# EasyEDA Pro project ProPrj_降压模块_2024-09-24.epro

# Schematic Schematic1
Board Name: Board1; Create Date: 2024-09-06
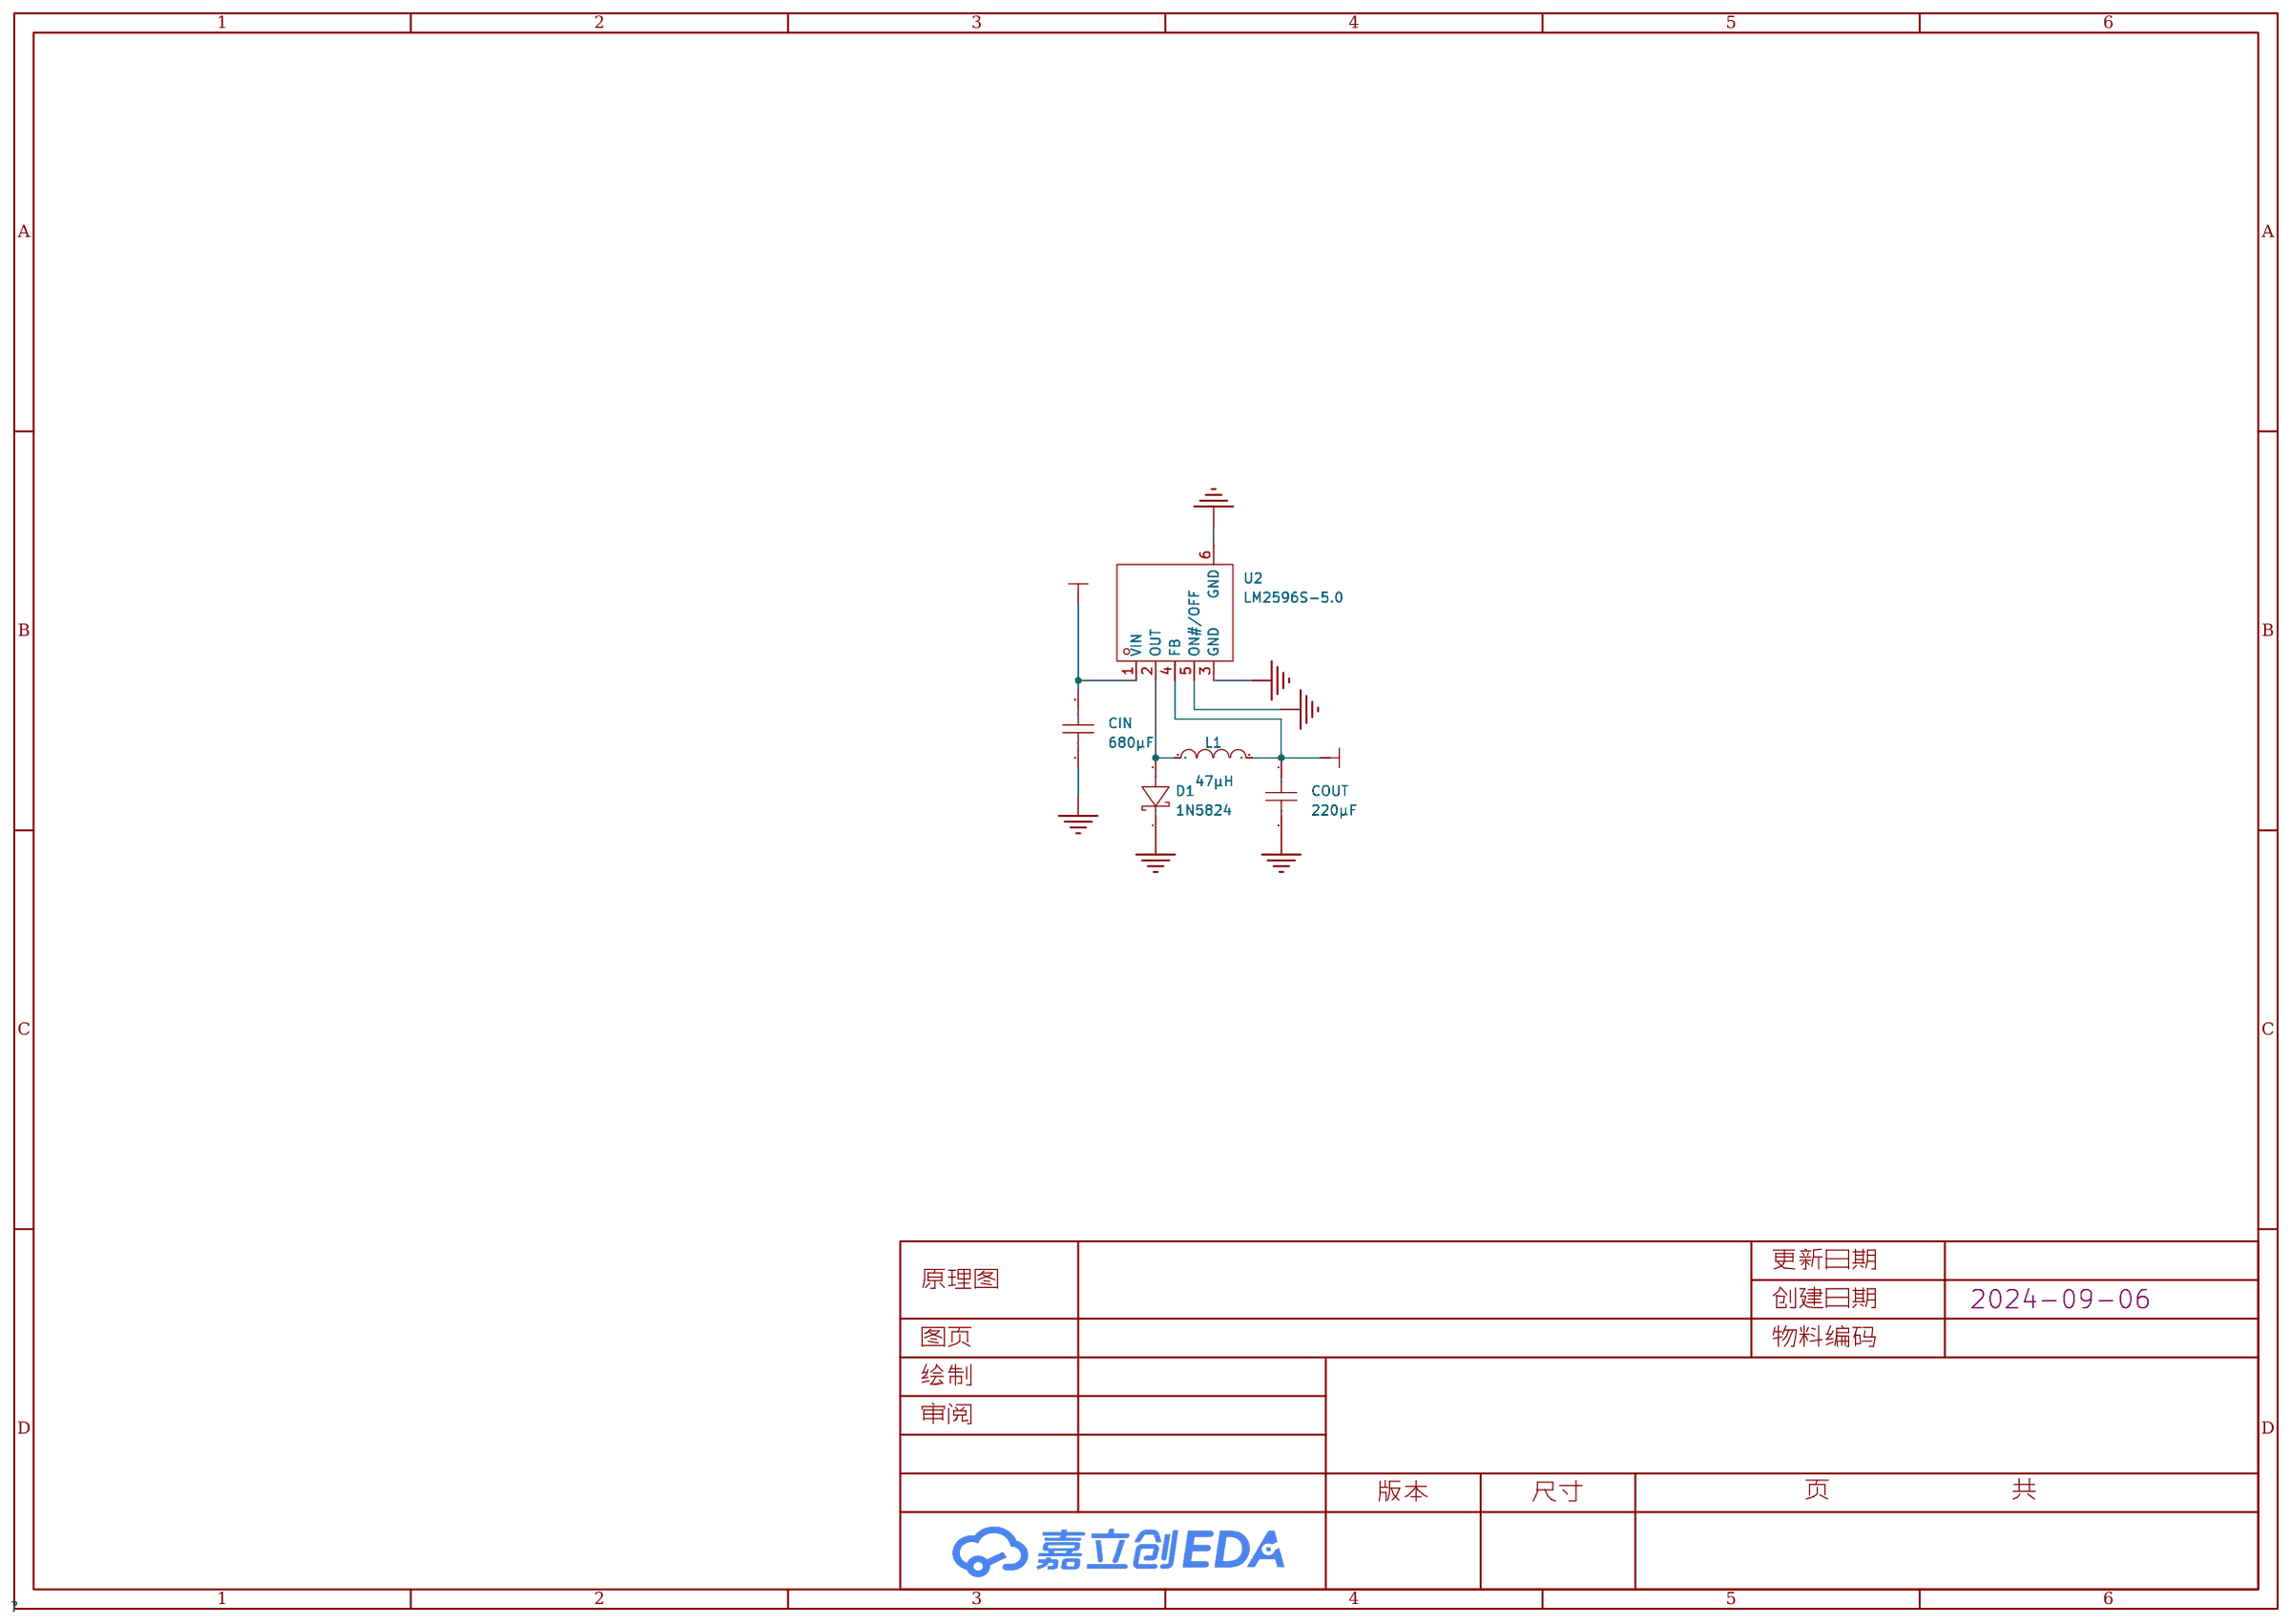
[diagram p0: schematic sheet]

## Parts
CIN  680μF  [C0603]
COUT  220μF  [C0603]
D1  1N5824  [DO-27_BD5.3-L8.4-P12.40-D1.3-RD]
L1  47μH  [L0603]
U2  LM2596S-5.0  [TO-263-5_L10.1-W8.7-P1.70-LS15.2-BR]

## Library data of the parts
CIN COUT = CAP_0603: Supplier Footprint: 0603
D1 = 1N5824_C7503125: 二极管配置:独立式;正向压降(Vf):550mV@5A;直流反向耐压(Vr):30V;平均整流电流(Io):5A;; LCSC Part Name: 电压:30V 电流:5A; Supplier Part: C7503125; Manufacturer: FUXINSEMI(富芯森美); Supplier Footprint: DO-201AD; JLCPCB Part Class: 扩展库; Datasheet: https://atta.szlcsc.com/upload/public/pdf/source/20230904/20F3394C6D1B7A17743713246CA97DB3.pdf; Supplier: LCSC; Diode Configuration: 独立式; Forward Voltage (Vf@If): 550mV@5A; Reverse Voltage (Vr): 30V; Average Rectified Current (Io): 5A; Reverse Leakage Current (Ir): 500uA@30V; Peak forward surge current: 150A
L1 = L_0603
U2 = LM2596S-5.0_C5276750: 功能类型：降压型 输出类型：固定 输入电压：40V 输出电压：5V 输出电流(最大值)：3A; Supplier Part: C5276750; Manufacturer: TWGMC(台湾迪嘉); Supplier Footprint: TO-263-5; JLCPCB Part Class: 扩展库; Datasheet: https://atta.szlcsc.com/upload/public/pdf/source/20221121/BE66229392871E6008E3503EDFD620B9.pdf; Supplier: LCSC

## Nets
5V: COUT.2 L1.2 U2.4(FB)
24V: CIN.2 U2.1(VIN)
GND: CIN.1 COUT.1 D1.1(K) U2.3(GND) U2.5(ON#/OFF) U2.6(GND)
$1N3601: D1.2(A) L1.1 U2.2(OUT)

# Board PCB1
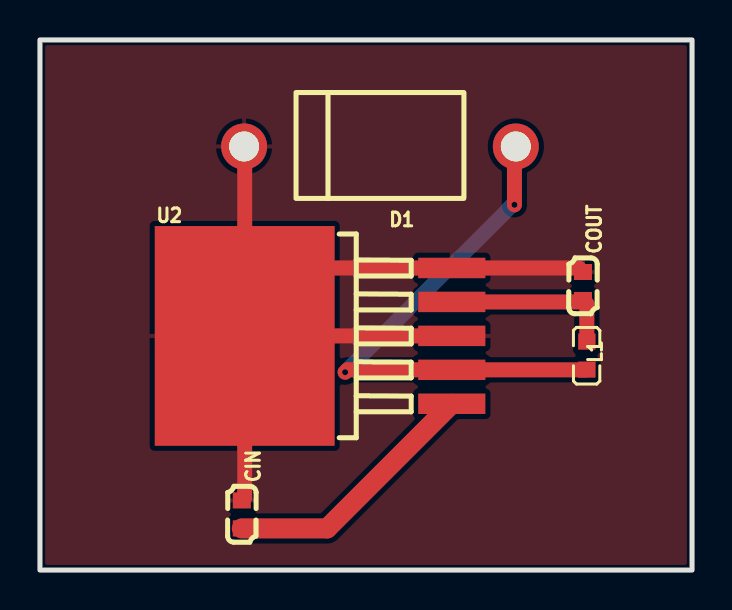
[diagram p1: board, top side]
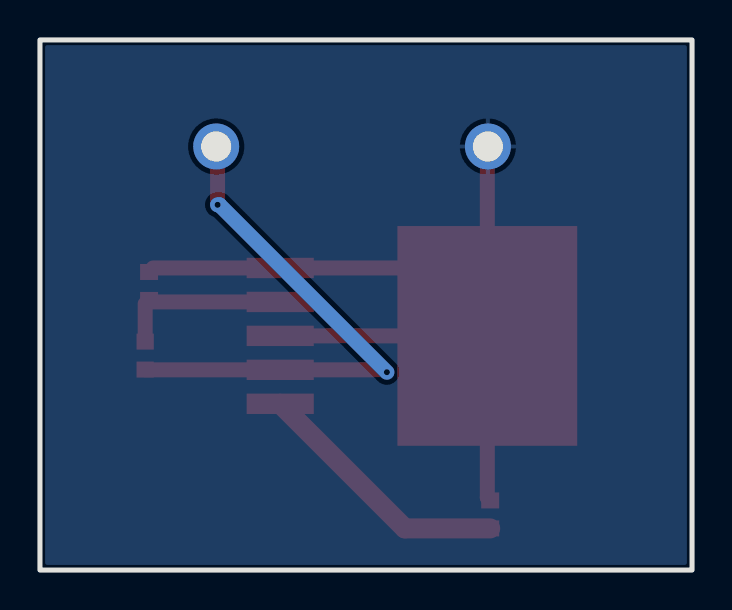
[diagram p2: board, bottom side, seen from below]

Outline 32.64 x 26.54 mm; copper layers: Top Layer, Bottom Layer. Coordinates in mm from the lower left corner of the outline.
Outline path: rectangle 0,26.54 32.64,0
Stack: Top Layer 0.035mm / Dielectric1 1.51mm FR4 er 4.5 / Bottom Layer 0.035mm

## Design rules (mm)
template: JLCPCB Capability(Two Layers Board)
spacing copperThickness1oz (default): track to track 0.102, other pairs 0.152 to 0.3
spacing copperThickness2oz: track to track 0.203, other pairs 0.152 to 0.3
track width copperThickness1oz (default): min 0.127, default 0.254, max 2.54
track width copperThickness2oz: min 0.203, default 0.254, max 2.54
differential pair differentialPair (default): width min 0.127, default 0.254, max 2.54; gap min 0.152, default 0.152
via viaSize (default): diameter min 0.5, default 0.61, max 10; hole min 0.3, default 0.305, max 6.3

## Placement (name value [footprint] x y rotation side)
CIN  680μF  [C0603]  10.1 2.79 270 top
COUT  220μF  [C0603]  27.18 14.22 270 top
D1  1N5824  [DO-27_BD5.3-L8.4-P12.40-D1.3-RD]  17.02 21.21 0 top
L1  47μH  [L0603]  27.37 10.74 90 top
U2  LM2596S-5.0  [TO-263-5_L10.1-W8.7-P1.70-LS15.2-BR]  15.43 11.73 0 top

## Footprints (pads in the part's own frame, mm; a bottom-side part is the same pattern mirrored in y, then rotated)
C0603
  rect 0.8x0.9 smd: 1(-0.7,0) 2(0.7,0)
DO-27_BD5.3-L8.4-P12.40-D1.3-RD
  round 2.3 hole 1.5: 1(-6.8,0) 2(6.8,0)
L0603
  rect 0.8x0.864 smd: 1(-0.7,0) 2(0.7,0)
TO-263-5_L10.1-W8.7-P1.70-LS15.2-BR
  rect 3.358x1.02 smd: 1(5.183,-3.4) 2(5.183,-1.7) 3(5.183,0) 4(5.183,1.7) 5(5.183,3.4)
  rect 9x11 smd: 6(-5.184,0)

## Nets
As in the schematic.

## Via types
v1: diameter 0.61, hole 0.305, Top Layer to Bottom Layer, 2 vias

## Routing (per net, layer and track width the routed paths; a pad name or vN(x,y) marks a point on that pad's centre or on a via; arc(x,y) is an arc through that point)
5V: length 8.8
  Top Layer w0.254: 27.37,13.33 COUT.2 27.08,13.43
  Top Layer w0.75: L1.2 27.37,13.33 ; 27.08,13.43 U2.4
24V: length 13.1
  Top Layer w1: U2.1 14.37,2.09 CIN.2
GND: length 47
  Top Layer w0.254: 10.09,21.59 10.25,21.43 ; 26.98,15.12 COUT.1
  Top Layer w0.75: 26.98,15.12 U2.5 13.65,15.12 U2.6 ; U2.6 10.25,3.63 CIN.1 ; U2.6 U2.3 ; U2.6 10.25,21.43
$1N3601: length 27.3
  Top Layer w0.254: L1.1 27.36,10.03 ; 23.75,21.39 23.82,21.46
  Top Layer w0.75: v1(23.75,18.29) 23.75,21.39 ; 27.36,10.03 U2.2 15.39,10.03 v1(15.27,9.91)
  Bottom Layer w0.75: v1(15.27,9.91) 23.66,18.29 v1(23.75,18.29)

## Copper pours and planes (outline as drawn; the poured copper is in the pictures)
GND on Top Layer: -5.08,28.96 36.58,28.96 36.58,-2.67 -5.08,-2.67
GND on Bottom Layer: -6.6,30.35 39.37,30.35 39.37,-3.56 -6.6,-3.56
